# Altium schematic sheet Esquematico.SchDoc
size A4; SheetNumber: 1; SheetTotal: 1; SPICEModelCacheLSDRRVPY: <root> / <DocumentId>LSDRRVPY</DocumentId> / </root>
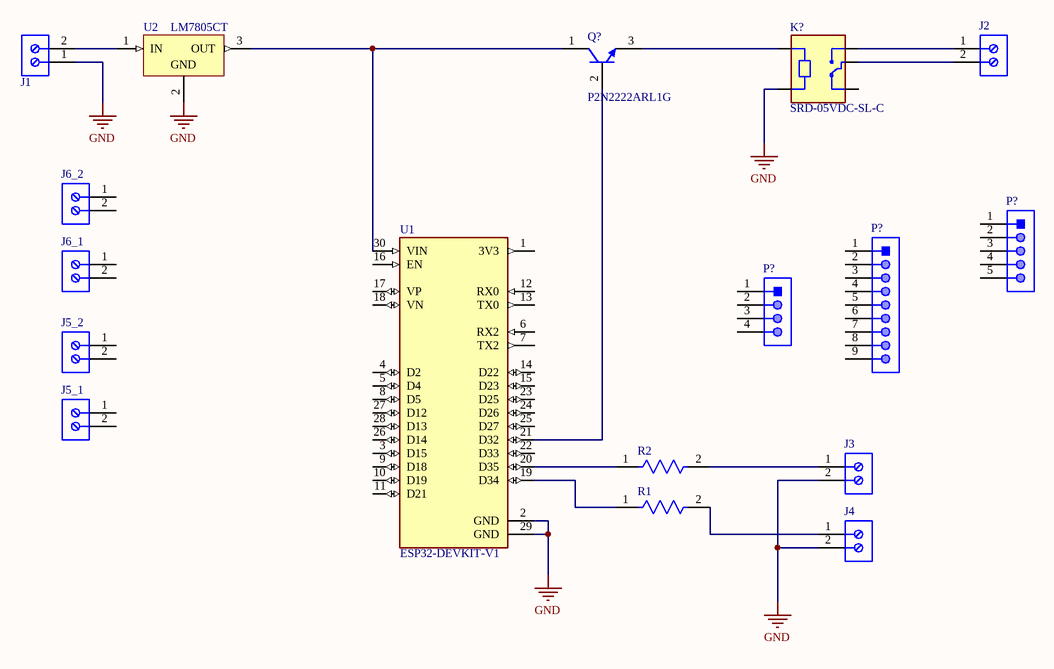
[diagram p0: Esquematico.SchDoc]

## Parts
(Parts that share a designator on the sheet are numbered #1, #2 ... from top to bottom, then left to right.)
J1  691103110002  [691103110002]  (value not drawn)
J2  691103110002  [691103110002]  (value not drawn)
J3  691103110002  [691103110002]  (value not drawn)
J4  691103110002  [691103110002]  (value not drawn)
J5_1  691103110002  [691103110002]  (value not drawn)
J5_2  691103110002  [691103110002]  (value not drawn)
J6_1  691103110002  [691103110002]  (value not drawn)
J6_2  691103110002  [691103110002]  (value not drawn)
K?  SRD-05VDC-SL-C  [RELAY_SRD-05VDC-SL-C]
P?#1  61300511021  [61300511021]  (value not drawn)
P?#2  61300911021  [61300911021]  (value not drawn)
P?#3  61300411021  [61300411021]  (value not drawn)
Q?  P2N2222ARL1G  [ONSC-TO-92-3-29-11_AM_BL]
R1  MFR-25FBF52-1K18  [FP-MFR-25-MFG]  (value not drawn)
R2  MFR-25FBF52-1K18  [FP-MFR-25-MFG]  (value not drawn)
U1  ESP32-DEVKIT-V1  [MODULE_ESP32_DEVKIT_V1]
U2  LM7805CT  [FAIR-TO-220-3]

## Nets
GND: J1.1 J3.2 J4.2 K?.A2 U1.2(GND) U1.29(GND) U2.2(GND)
NetJ1_2: J1.2 U2.1(IN)
NetJ2_1: J2.1 K?.NO
NetJ2_2: J2.2 K?.COM
NetJ3_1: J3.1 R2.2
NetJ4_1: J4.1 R1.2
NetK?_A1: K?.A1 Q?.3(E)
NetQ?_1: Q?.1(C) U1.30(VIN) U2.3(OUT)
NetQ?_2: Q?.2(B) U1.21(D32)
NetR1_1: R1.1 U1.19(D34)
NetR2_1: R2.1 U1.20(D35)

Not connected (* = marked no-connect by the designer): J5_1 1 2; J5_2 1 2; J6_1 1 2; J6_2 1 2; K? NC; P?#1 1 2 3 4 5; P?#2 1 2 3 4 5 6 7 8 9; P?#3 1 2 3 4; U1 1(3V3) 3(D15) 4(D2) 5(D4) 6(RX2) 7(TX2) 8(D5) 9(D18) 10(D19) 11(D21) 12(RX0) 13(TX0) 14(D22) 15(D23) 16(EN) 17(VP) 18(VN) 22(D33) 23(D25) 24(D26) 25(D27) 26(D14) 27(D12) 28(D13)

## Library data of the parts
J1-J4 J5_1 J5_2 J6_1 J6_2 = CMP-1502-03254-1: Series 1031 - 3.50 mm Horizontal Entry Modular with Pressure Clamp WR-TBL, 2 pin; Manufacturer: Wurth Elektronik; Pin Number: 2; Pitch: 3.50mm; Datasheet URL: http://katalog.we-online.de/em/datasheet/6911031100xx.pdf; Package Reference: 691103110002; Publisher: WurthElektronik; Manufacturer URL: http://www.we-online.de; Mounting Technology: THT; Operating Temperature: -40to105degC; Part Number: 691103110002; Packaging: Box
K? = SRD-05VDC-SL-C: 5V Trigger Relay Module For Arduino And Raspberry Pi 5V Trigger Relay Module For Arduino And Raspberry Pi; MF: Songle Relay; Package: None; Value: *; Availability: Not in stock; SnapEDA_Link: https://www.snapeda.com/parts/SRD-05VDC-SL-C/Songle+Relay/view-part/?ref=snap; Price: None; MP: SRD-05VDC-SL-C; Check_prices: https://www.snapeda.com/parts/SRD-05VDC-SL-C/Songle+Relay/view-part/?ref=eda
P?#1 = CMP-1502-01067-1: THT Angled Pin Header WR-PHD, Pitch 2.54 mm, Single Row, 5 pins; Manufacturer: Wurth Elektronik; Working Voltage: 250VAC; Withstanding Voltage: 500VAC; Gender: Male; Contact Resistance: 20mOhm; Rated Current: 3A; Pitch: 2.54mm; Pin Number: 5; Orientation: Angled; Packaging: Bag; Package Reference: 61300511021; Mounting Technology: THT; Publisher: WurthElektronik; Row Number: Single; Operating Temperature: -40to105degC; Part Number: 61300511021; Datasheet URL: https://katalog.we-online.de/em/datasheet/6130xx11021.pdf; Manufacturer URL: http://www.we-online.de
P?#2 = CMP-1502-01079-1: THT Angled Pin Header WR-PHD, Pitch 2.54 mm, Single Row, 9 pins; Manufacturer: Wurth Elektronik; Working Voltage: 250VAC; Withstanding Voltage: 500VAC; Contact Resistance: 20mOhm; Pitch: 2.54mm; Gender: Male; Rated Current: 3A; Pin Number: 9; Orientation: Angled; Row Number: Single; Datasheet URL: https://katalog.we-online.de/em/datasheet/6130xx11021.pdf; Part Number: 61300911021; Manufacturer URL: http://www.we-online.de; Publisher: WurthElektronik; Package Reference: 61300911021; Operating Temperature: -40to105degC; Packaging: Bag; Mounting Technology: THT
P?#3 = CMP-1502-01063-1: THT Angled Pin Header WR-PHD, Pitch 2.54 mm, Single Row, 4 pins; Manufacturer: Wurth Elektronik; Gender: Male; Pin Number: 4; Withstanding Voltage: 500VAC; Working Voltage: 250VAC; Contact Resistance: 20mOhm; Pitch: 2.54mm; Rated Current: 3A; Manufacturer URL: http://www.we-online.de; Mounting Technology: THT; Publisher: WurthElektronik; Operating Temperature: -40to105degC; Packaging: Bag; Row Number: Single; Package Reference: 61300411021; Part Number: 61300411021; Orientation: Angled; Datasheet URL: https://katalog.we-online.de/em/datasheet/6130xx11021.pdf
Q? = CMP-1048-01587-1: Amplifier Transistor, NPN Silicon, 3-Pin TO-92, Pb-Free, Tape and Reel; Manufacturer: On Semiconductor; IC Continuous (A): 0.6; fT Min (MHz): 300; PackageDescription: 3-Pin Transistor Outline, Body 4.825 x 3.685 mm, Pitch 1.27 mm; PackageReference: TO-92-3-29-11_AM_BL; DatasheetVersion: Rev. 7; ComponentLink2Description: Datasheet; RoHS: TRUE; ComponentLink1Description: Manufacturer URL; ComponentLink1URL: http://www.onsemi.com/; PackageVersion: Rev. AM; Polarity: NPN; ComponentLink3Description: Package Specification; PartNumber: P2N2222ARL1G; ComponentLink3URL: http://www.onsemi.com/pub_link/Collateral/MAC97-D.PDF; Mounting Technology: Through Hole; ComponentLink2URL: http://www.onsemi.com/pub_link/Collateral/P2N2222A-D.PDF; Packing: Tape and Reel
R1 R2 = CMP-03413-000001-1: RES 1.18K OHM 1/4W 1% AXIAL; Manufacturer: Yageo; Value: 1.18kΩ; Description: 1.18 kOhms ±1% 0.25W, 1/4W Through Hole Resistor Axial  Metal Film; Temperature Coefficient: 100ppm/°C; Power Rating: 0.25W; Voltage Rating: 250V; Temperature: -55°C to +155°C; Automotive: No; Temperature Range High: +155°C; Mouser Description: Metal Film Resistors 1.18K OHM 1/4W 1%; Digikey Description: RES 1.18K OHM 1/4W 1% AXIAL; Lead Free: Yes; Tolerance: 1%; ComponentLink2Description: Datasheet; ComponentLink2URL: https://www.yageo.com/upload/media/product/products/datasheet/lr/Yageo_LR_MFR_1.pdf; Temperature Range Low: -55°C; Package: MFR-25; Ipc Land Pattern Name: RESAD1000W75L680D260; Composition: Metal Film; Category: Res; Octopart: https://octopart.com/mfr-25fbf52-1k18-yageo-56251681; Series: MFR; Device Class L2: Resistors; Height: 2.6mm; Resistance: 1.18kΩ; Device Class L3: Through-Hole Resistors; Manufacturer Part Number: MFR-25FBF52-1K18; RoHS: TRUE; Device Class L1: Passive Components
U1 = ESP32-DEVKIT-V1: Dual core, Wi-Fi: 2.4 GHz up to 150 Mbits/s,BLE (Bluetooth Low Energy) and legacy Bluetooth, 32 bits, Up to 240 MHz; MF: Do it; Value: *; MP: ESP32-DEVKIT-V1; SnapEDA_Link: https://www.snapeda.com/parts/ESP32-DEVKIT-V1/Do+it/view-part/?ref=snap; Price: None; Package: None; Check_prices: https://www.snapeda.com/parts/ESP32-DEVKIT-V1/Do+it/view-part/?ref=eda; Availability: Not in stock
U2 = CMP-2000-04938-1: Positive Voltage Regulator, 5 V, 1 A, -40 to 125 degC, 3-Pin TO-220, RoHS, Tube; Manufacturer: FairchildSemiconductor; Maximum Input Voltage: 35V; Maximum Quiescent Current: 8mA; Load Regulation: 100mV; Maximum Output Current: 2.2(Typ)A; Output Type: Fixed; Typical Dropout Voltage @ Current: 2@1AV; Rad Hard: No; Output Voltage: 5V; Accuracy: ±4%; Number of Outputs: 1; Category: LinearRegulator; Package Description: 3-Pin Through Hole Device, Body 10 x 4.5 mm, Pitch 2.54 mm; Packaging: Rail/Tube; Mounting: ThroughHole; Polarity: Positive; Manufacturer URL: https://www.fairchildsemi.com/; Line Regulation: 100mV; Datasheet Version: Aug-12; Datasheet URL: https://datasheet.ciiva.com/26904/lm7805ct-26904988.pdf; Package Reference: TO-220; Package URL: https://www.fairchildsemi.com/package-drawings/TO/TO220B03.pdf; Package: 3TO-220AB; Operating Temperature: -40to125degC; Type: Linear